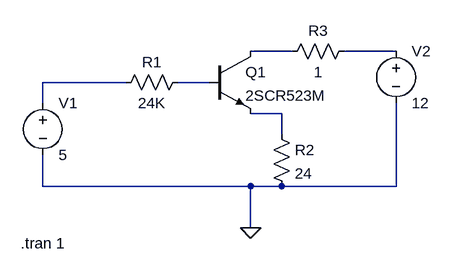
[diagram p0: schematic transistors_ltspice.asc]
transistors_ltspice.asc, the LTspice schematic file:
Version 4
SHEET 1 880 680
WIRE 192 128 128 128
WIRE 352 128 272 128
WIRE -64 176 -192 176
WIRE 64 176 16 176
WIRE -192 208 -192 176
WIRE 176 224 128 224
WIRE 176 256 176 224
WIRE -192 336 -192 288
WIRE 128 336 -192 336
WIRE 176 336 128 336
WIRE 352 336 352 208
WIRE 352 336 176 336
WIRE 128 400 128 336
FLAG 128 400 0
SYMBOL npn3 64 128 R0
SYMATTR InstName Q1
SYMATTR Value 2SCR523M
SYMBOL voltage -192 192 R0
WINDOW 123 0 0 Left 0
WINDOW 39 0 0 Left 0
SYMATTR InstName V1
SYMATTR Value 5
SYMBOL res 32 160 R90
WINDOW 0 0 56 VBottom 2
WINDOW 3 32 56 VTop 2
SYMATTR InstName R1
SYMATTR Value 24K
SYMBOL res 160 240 R0
SYMATTR InstName R2
SYMATTR Value 24
SYMBOL voltage 352 112 R0
WINDOW 123 0 0 Left 0
WINDOW 39 0 0 Left 0
SYMATTR InstName V2
SYMATTR Value 12
SYMBOL res 288 112 R90
WINDOW 0 0 56 VBottom 2
WINDOW 3 32 56 VTop 2
SYMATTR InstName R3
SYMATTR Value 1
TEXT -226 424 Left 2 !.tran 1

The netlist it stands for:
* transistors_ltspice.asc
Q1 N001 N004 N005 0 2SCR523M
V1 N003 0 5
R1 N004 N003 24K
R2 N005 0 24
V2 N002 0 12
R3 N002 N001 1
.model NPN NPN
.model PNP PNP
.lib standard.bjt
.tran 1
.backanno
.end